# Altium schematic sheet sb-sonata-analoginput.SchDoc: Analog Conversion
size Letter; Organization: NewAE Technology Inc.; Address1: 1083 Queen St., Suite 196; Address2: Halifax; Address3: NS; Address4: Canada B3H 0B2; SheetNumber: 16; SheetTotal: 20; SheetApproved: YES
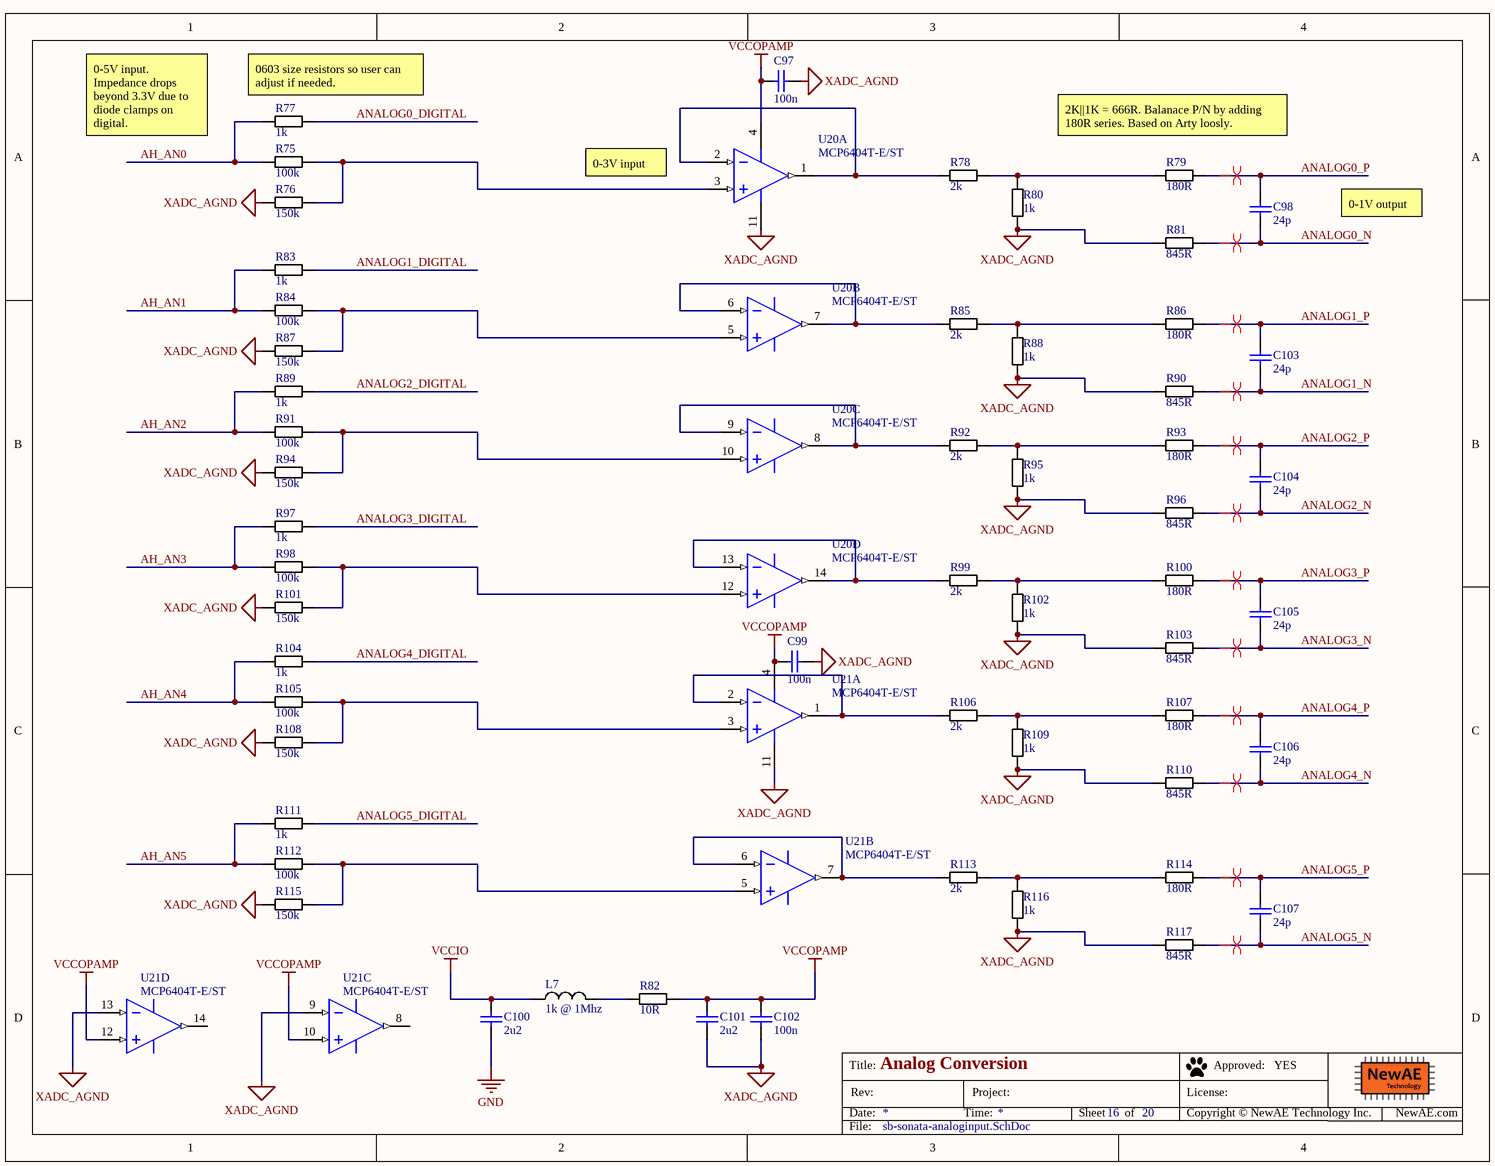
[diagram p0: sb-sonata-analoginput.SchDoc]

## Parts
C97  100n  [CAPC0402_M]
C98  24p  [CAPC0402_M]
C99  100n  [CAPC0402_M]
C100  2u2  [CAPC0603_M]
C101  2u2  [CAPC0603_M]
C102  100n  [CAPC0402_M]
C103  24p  [CAPC0402_M]
C104  24p  [CAPC0402_M]
C105  24p  [CAPC0402_M]
C106  24p  [CAPC0402_M]
C107  24p  [CAPC0402_M]
L7  1k @ 1Mhz  [IND_0603]
R75  100k  [RESC1608X55N]
R76  150k  [RESC1608X55N]
R77  1k  [RESC1608X55N]
R78  2k  [RESC1005X40N]
R79  180R  [RESC1005X40N]
R80  1k  [RESC1005X40N]
R81  845R  [RESC1005X40N]
R82  10R  [RESC1608X55N]
R83  1k  [RESC1608X55N]
R84  100k  [RESC1608X55N]
R85  2k  [RESC1005X40N]
R86  180R  [RESC1005X40N]
R87  150k  [RESC1608X55N]
R88  1k  [RESC1005X40N]
R89  1k  [RESC1608X55N]
R90  845R  [RESC1005X40N]
R91  100k  [RESC1608X55N]
R92  2k  [RESC1005X40N]
R93  180R  [RESC1005X40N]
R94  150k  [RESC1608X55N]
R95  1k  [RESC1005X40N]
R96  845R  [RESC1005X40N]
R97  1k  [RESC1608X55N]
R98  100k  [RESC1608X55N]
R99  2k  [RESC1005X40N]
R100  180R  [RESC1005X40N]
R101  150k  [RESC1608X55N]
R102  1k  [RESC1005X40N]
R103  845R  [RESC1005X40N]
R104  1k  [RESC1608X55N]
R105  100k  [RESC1608X55N]
R106  2k  [RESC1005X40N]
R107  180R  [RESC1005X40N]
R108  150k  [RESC1608X55N]
R109  1k  [RESC1005X40N]
R110  845R  [RESC1005X40N]
R111  1k  [RESC1608X55N]
R112  100k  [RESC1608X55N]
R113  2k  [RESC1005X40N]
R114  180R  [RESC1005X40N]
R115  150k  [RESC1608X55N]
R116  1k  [RESC1005X40N]
R117  845R  [RESC1005X40N]
U20  MCP6404T-E/ST  [TSSOP-ST14_M]  (parts A,B,C,D of 4)
U21  MCP6404T-E/ST  [TSSOP-ST14_M]  (parts A,B,C,D of 4)

## Nets
GND: C100.2
VCCIO: C100.1 L7.1
VCCOPAMP: C97.1 C99.1 C101.1 C102.1 R82.2 U20.4(VDD) U21.4(VDD) U21.10(VINC+) U21.12(VIND+)
XADC_AGND: C97.2 C99.2 C101.2 C102.2 R76.1 R80.2 R81.1 R87.1 R88.2 R90.1 R94.1 R95.2 R96.1 R101.1 R102.2 R103.1 R108.1 R109.2 R110.1 R115.1 R116.2 R117.1 U20.11(VSS) U21.9(VINC-) U21.11(VSS) U21.13(VIND-)
AH_AN0: R75.1 R77.1
AH_AN1: R83.1 R84.1
AH_AN2: R89.1 R91.1
AH_AN3: R97.1 R98.1
AH_AN4: R104.1 R105.1
AH_AN5: R111.1 R112.1
ANALOG0_DIGITAL: R77.2
ANALOG0_N: C98.2 R81.2
ANALOG0_P: C98.1 R79.2
ANALOG1_DIGITAL: R83.2
ANALOG1_N: C103.2 R90.2
ANALOG1_P: C103.1 R86.2
ANALOG2_DIGITAL: R89.2
ANALOG2_N: C104.2 R96.2
ANALOG2_P: C104.1 R93.2
ANALOG3_DIGITAL: R97.2
ANALOG3_N: C105.2 R103.2
ANALOG3_P: C105.1 R100.2
ANALOG4_DIGITAL: R104.2
ANALOG4_N: C106.2 R110.2
ANALOG4_P: C106.1 R107.2
ANALOG5_DIGITAL: R111.2
ANALOG5_N: C107.2 R117.2
ANALOG5_P: C107.1 R114.2
NetL7_2: L7.2 R82.1
NetR75_2: R75.2 R76.2 U20.3(VINA+)
NetR78_1: R78.1 U20.1(VOUTA) U20.2(VINA-)
NetR78_2: R78.2 R79.1 R80.1
NetR84_2: R84.2 R87.2 U20.5(VINB+)
NetR85_1: R85.1 U20.6(VINB-) U20.7(VOUTB)
NetR85_2: R85.2 R86.1 R88.1
NetR91_2: R91.2 R94.2 U20.10(VINC+)
NetR92_1: R92.1 U20.8(VOUTC) U20.9(VINC-)
NetR92_2: R92.2 R93.1 R95.1
NetR98_2: R98.2 R101.2 U20.12(VIND+)
NetR99_1: R99.1 U20.13(VIND-) U20.14(VOUTD)
NetR99_2: R99.2 R100.1 R102.1
NetR105_2: R105.2 R108.2 U21.3(VINA+)
NetR106_1: R106.1 U21.1(VOUTA) U21.2(VINA-)
NetR106_2: R106.2 R107.1 R109.1
NetR112_2: R112.2 R115.2 U21.5(VINB+)
NetR113_1: R113.1 U21.6(VINB-) U21.7(VOUTB)
NetR113_2: R113.2 R114.1 R116.1

Not connected (* = marked no-connect by the designer): U21 8(VOUTC) 14(VOUTD)

## Layout directives
differential pair; Parameter 1: ANALOG_DIFF_PAIR: ANALOG0_N, ANALOG0_P, ANALOG1_N, ANALOG1_P, ANALOG2_N, ANALOG2_P, ANALOG3_N, ANALOG3_P, ANALOG4_N, ANALOG4_P, ANALOG5_N, ANALOG5_P

## Notes on the sheet
- (near R77) 0603 size resistors so user can adjust if needed.
- 0-5V input. Impedance drops beyond 3.3V due to diode clamps on digital.
- 0-3V input
- (near R79) 2K||1K = 666R. Balanace P/N by adding 180R series. Based on Arty loosly.
- 0-1V output
- Title:
- Date:
- Rev:
- Time:
- Project:
- Sheet
- of
- License:
- Copyright © NewAE Technology Inc.
- Approved:
- NewAE.com
- File:

## Library data of the parts
C97 C99 C102 = CCHIP-100n-0402: 100n, 0402; Manufacture Part Number 1: CGA2B3X7R1V104K050BB; Component Group: Capacitor; Case-EIA: 0402; Part Number: CCHIP-100n-0402; Footprint: 0402; Pin Count: 2; Supplier 1: Digi-Key; Supplier Part Number 1: 445-6901-1-ND; Value: 100n; Mounting Technology: SMT; Component Kind: Standard; Component Type: Standard
C98 C103-C107 = CCHIP-24p-0402: 24p, 0402; Manufacture 1: Murata Electronics; Manufacture Part Number 1: GCM1555C1H240FA16D; Component Group: Capacitor; Case-EIA: 0402; Case-Metric: 1005; Rated Voltage: 50V; Part Number: CCHIP-24p-0402; Footprint: 0402; Pin Count: 2; Supplier 1: Digi-Key; Supplier Part Number 1: 490-GCM1555C1H240FA16DTR-ND; Value: 24p; Mounting Technology: SMT; RoHS: Yes; Component Kind: Standard; Component Type: Standard
C100 C101 = CCHIP-2u2-0603: 2u2, 0603; Manufacture 1: Samsung; Manufacture Part Number 1: CL10B225KP8NNNC; Component Group: Capacitor; Case-EIA: 0603; Case-Metric: 1608; Rated Voltage: 10VDC; Part Number: CCHIP-2u2-0603; Footprint: 0603; Pin Count: 2; Supplier 1: Digi-Key; Supplier Part Number 1: 1276-1134-1-ND; Value: 2u2; Mounting Technology: SMT; Component Kind: Standard; Component Type: Standard
L7 = FBCHIP-1k-0603: Ferrite Beads HI CUR CHIP BD 0603 1000OHMS 25%; Manufacture 1: Taiyo Yuden; Manufacture Part Number 1: FBMH1608HM102-T / FBMH1608HM102-T / FBMH1608HM102-T / FBMH1608HM102-T; Component Group: Inductor; PP Material Stack: 0; Part Number: FBCHIP-1k-0603; Footprint: 0603; Pin Count: 2; Supplier 1: Mouser; Supplier Part Number 1: 963-FBMH1608HM102-T; Mounting Technology: SMT; RoHS: Yes; Component Kind: Standard; Component Type: Standard; PP Rotation: 0
R75 R84 R91 R98 R105 R112 = RCHIP-100K-0603: 100k res, 0603, 1%, 1/10W; Manufacture 1: Yageo; Manufacture Part Number 1: RC0603FR-07100KL; Component Group: Resistor; Case-EIA: 0603; Case-Metric: 1608; Rated Power: 0.1W; Rated Voltage: 75VDC; Part Number: RCHIP-100K-0603; Footprint: 0603; Pin Count: 2; Supplier 1: Digi-Key; Supplier Part Number 1: 311-100KHRCT-ND; Value: 100k; Tolerance: 1%; Mounting Technology: SMT; Temperature Range: -55C to 155C; Component Kind: Standard; Component Type: Standard
R76 R87 R94 R101 R108 R115 = RCHIP-150K-0603: 150k res, 0603, 1%, 1/10W; Manufacture 1: Yageo; Manufacture Part Number 1: RC0603FR-07150KL; Component Group: Resistor; Case-EIA: 0603; Case-Metric: 1608; Rated Power: 0.1W; Rated Voltage: 75VDC; Part Number: RCHIP-150K-0603; Footprint: 0603; Pin Count: 2; Supplier 1: Digi-Key; Supplier Part Number 1: 311-150KHRCT-ND; Value: 150k; Tolerance: 1%; Mounting Technology: SMT; Temperature Range: -55C to 155C; Component Kind: Standard; Component Type: Standard
R77 R83 R89 R97 R104 R111 = RCHIP-1k-0603: 1k res, 0603, 1%, 1/10W; Manufacture 1: Yageo; Manufacture Part Number 1: RC0603FR-071KL; Component Group: Resistor; Case-EIA: 0603; Case-Metric: 1608; Rated Power: 0.1W; Rated Voltage: 75VDC; Part Number: RCHIP-1K-0603; Footprint: 0603; Pin Count: 2; Supplier 1: Digi-Key; Supplier Part Number 1: 311-1.00KHRCT-ND; Value: 1k; Tolerance: 1%; Mounting Technology: SMT; Temperature Range: -55C to 155C; Component Kind: Standard; Component Type: Standard
R78 R85 R92 R99 R106 R113 = RCHIP-2K-0402: 2k res, 0402, 1%, 1/16W; Manufacture 1: Yageo; Manufacture Part Number 1: RC0402FR-072KL; Component Group: Resistor; Case-EIA: 0402; Case-Metric: 1005; Rated Power: 0.063W; Rated Voltage: 75VDC; Part Number: RCHIP-2K-0402; Footprint: 0402; Pin Count: 2; Supplier 1: Digi-Key; Supplier Part Number 1: 311-2KLRCT-ND; Value: 2k; Tolerance: 1%; Mounting Technology: SMT; Temperature Range: -55C to 155C; Component Kind: Standard; Component Type: Standard
R79 R86 R93 R100 R107 R114 = RCHIP-180R-0402: 180R res, 0402, 1%, 1/16W; Manufacture 1: Yageo; Manufacture Part Number 1: RC0402FR-07180RL; Component Group: Resistor; Case-EIA: 0402; Case-Metric: 1005; Rated Power: 0.063W; Rated Voltage: 75VDC; Part Number: RCHIP-180R-0402; Footprint: 0402; Pin Count: 2; Supplier 1: Digi-Key; Supplier Part Number 1: 311-180LRCT-ND; Value: 180R; Tolerance: 1%; Mounting Technology: SMT; Temperature Range: -55C to 155C; Component Kind: Standard; Component Type: Standard
R80 R88 R95 R102 R109 R116 = RCHIP-1K-0402: 1k res, 0402, 1%, 1/16W; Manufacture 1: Yageo; Manufacture Part Number 1: RC0402FR-071KL; Component Group: Resistor; Case-EIA: 0402; Case-Metric: 1005; Rated Power: 0.063W; Rated Voltage: 75VDC; Part Number: RCHIP-1K-0402; Footprint: 0402; Pin Count: 2; Supplier 1: Digi-Key; Supplier Part Number 1: 311-1.00KLRCT-ND; Value: 1k; Tolerance: 1%; Mounting Technology: SMT; Temperature Range: -55C to 155C; Component Kind: Standard; Component Type: Standard
R81 R90 R96 R103 R110 R117 = RCHIP-845R-0402: 845R res, 0402, 1%, 1/16W; Manufacture 1: Yageo; Manufacture Part Number 1: RC0402FR-07845RL; Component Group: Resistor; Case-EIA: 0402; Case-Metric: 1005; Rated Power: 0.063W; Rated Voltage: 75VDC; Part Number: RCHIP-845R-0402; Footprint: 0402; Pin Count: 2; Supplier 1: Digi-Key; Supplier Part Number 1: YAG3244CT-ND; Value: 845R; Tolerance: 1%; Mounting Technology: SMT; Temperature Range: -55C to 155C; Component Kind: Standard; Component Type: Standard
R82 = RCHIP-10R-0603: 10R res, 0603, 1%, 1/10W; Manufacture 1: Yageo; Manufacture Part Number 1: RC0603FR-0710RL; Component Group: Resistor; Case-EIA: 0603; Case-Metric: 1608; Rated Power: 0.1W; Rated Voltage: 75VDC; Part Number: RCHIP-10R-0603; Footprint: 0603; Pin Count: 2; Supplier 1: Digi-Key; Supplier Part Number 1: 311-10.0HRCT-ND; Value: 10R; Tolerance: 1%; Mounting Technology: SMT; Temperature Range: -55C to 155C; Component Kind: Standard; Component Type: Standard
U20 U21 = CMP-0187-00805-2: None; Nominal Supply Current: 45uA; Power Supply Rejection Ratio (PSRR): 63dB; Unity Gain Bandwidth Product: 1MHz; Amplifier Type: GENERAL PURPOSE; Voltage Gain: 110dB; Number of Channels: 4; Output Current: 15mA; Max Supply Voltage: 6V; Min Supply Voltage: 1.8V; Slew Rate: 0.5V/µs; Input Bias Current: 100pA; Input Offset Voltage (Vos): 4.5mV; Common Mode Rejection Ratio: 56dB; Number of Pins: 14; Case/Package: TSSOP; Packaging: Tape and Reel; Technology: CMOS; Lead Free: Lead Free; Max Operating Temperature: 125°C; Mount: Surface Mount; Number of Circuits: 4; Number of Elements: 4; Supply Current: 45uA; RoHS Compliant: Yes; Gain Bandwidth Product: 1MHz; Min Operating Temperature: -40°C